# EAGLE design taGPS-1350 (EAGLE 7.5.0)
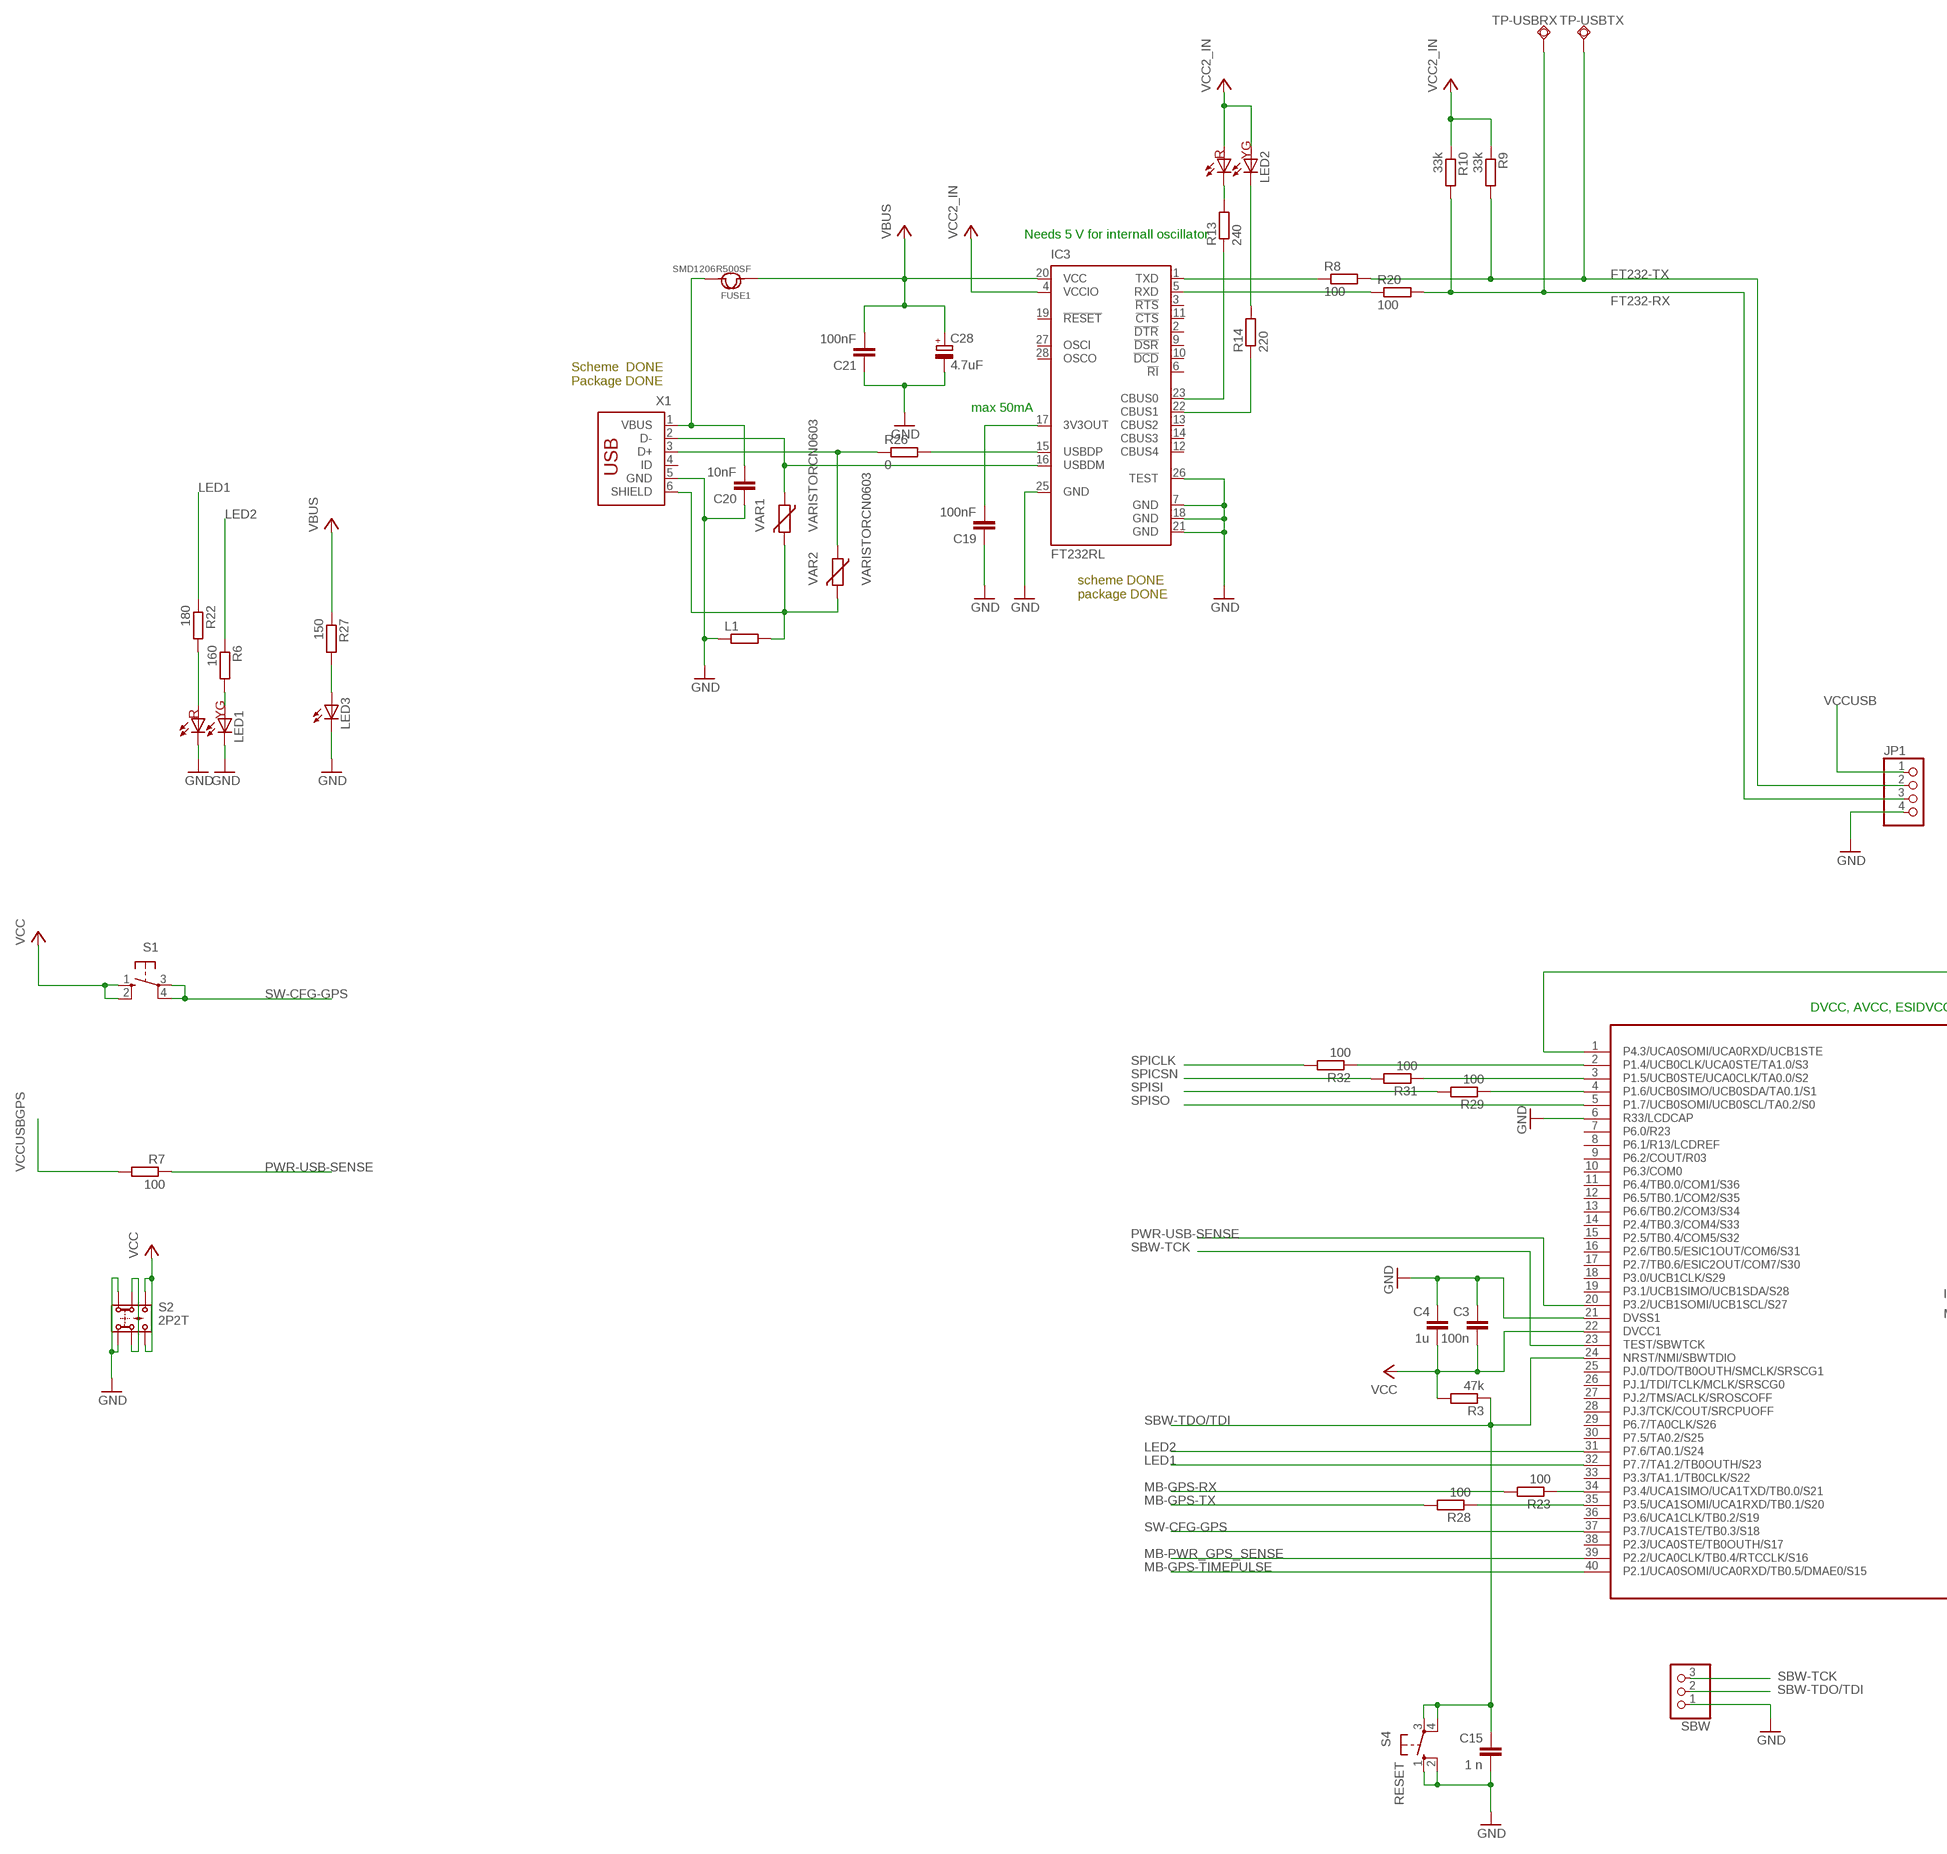
[diagram p0: schematic, sheet 1, part 1 of 2]
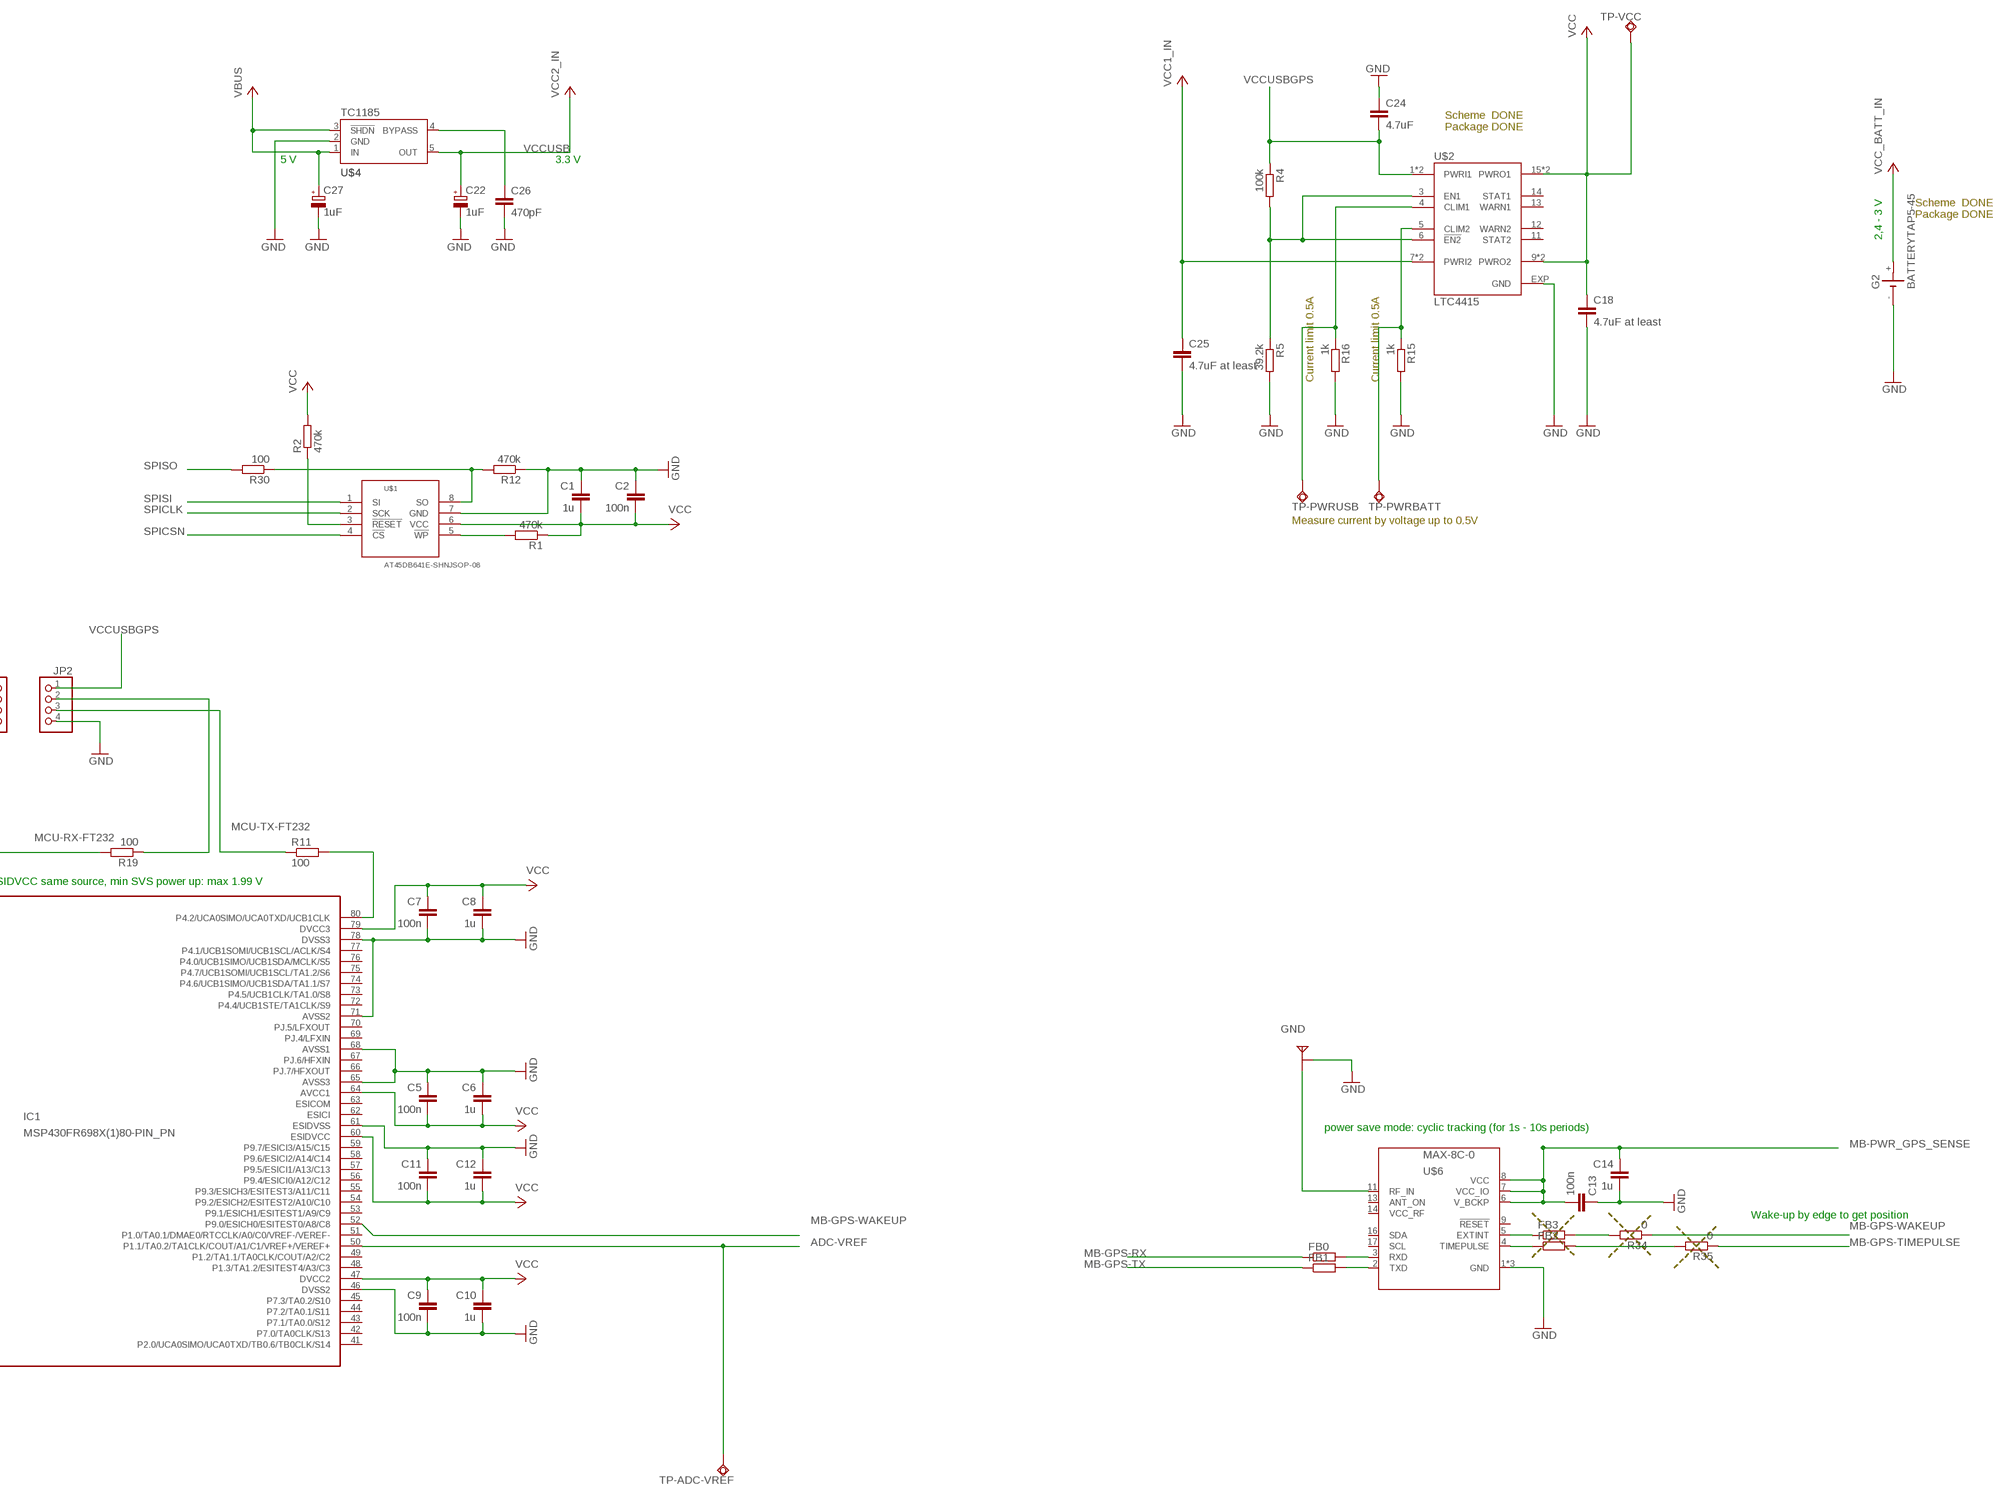
[diagram p1: schematic, sheet 1, part 2 of 2]

## Parts
C1  1u  C-EUC0603  [C0603]
C2  100n  C-EUC0603  [C0603]
C3  100n  C-EUC0603  [C0603]
C4  1u  C-EUC0603  [C0603]
C5  100n  C-EUC0603  [C0603]
C6  1u  C-EUC0603  [C0603]
C7  100n  C-EUC0603  [C0603]
C8  1u  C-EUC0603  [C0603]
C9  100n  C-EUC0603  [C0603]
C10  1u  C-EUC0603  [C0603]
C11  100n  C-EUC0603  [C0603]
C12  1u  C-EUC0603  [C0603]
C13  100n  C-EUC0603  [C0603]
C14  1u  C-EUC0603  [C0603]
C15  1 n  C-EUC0603  [C0603]
C18  4.7uF at least  C-EUC0805  [C0805]
C19  100nF  C-EUC0603  [C0603]
C20  10nF  C-EUC0603  [C0603]
C21  100nF  C-EUC0603  [C0603]
C22  1uF  CPOL-EUA/3216-18W  [A/3216-18W]
C24  4.7uF  C-EUC0805  [C0805]
C25  4.7uF at least  C-EUC0805  [C0805]
C26  470pF  C-EUC0603  [C0603]
C27  1uF  CPOL-EUA/3216-18W  [A/3216-18W]
C28  4.7uF  CPOL-EUA/3216-18W  [A/3216-18W]
FB0  R-EU_R0402  [R0402]
FB1  R-EU_R0402  [R0402]
FB2  R-EU_R0402  [R0402]
FB3  R-EU_R0402  [R0402]
FUSE1  SMD1206R500SF  SMD-PPTC-500MA-15V(1812)  [F1812]
G2  BATTERYTAP5-45  [TAP5-45]
IC1  MSP430FR698X(1)80-PIN_PN  [PN_S-PQFP-G80]
IC3  FT232RL  [SSOP28]
JP1  PINHD-1X4  [1X04]
JP2  PINHD-1X4  [1X04]
L1  R-EU_R0603  [R0603]
LED1  BILEDBILED  [BILED]
LED2  BILEDBILED  [BILED]
LED3  LED_E  [LED_KINGBRIGHT0603]
R1  470k  R-EU_R0603  [R0603]
R2  470k  R-EU_R0603  [R0603]
R3  47k  R-EU_R0603  [R0603]
R4  100k  R-EU_R0603  [R0603]
R5  39.2k  R-EU_R0603  [R0603]
R6  160  R-EU_R0603  [R0603]
R7  100  R-EU_R0603  [R0603]
R8  100  R-EU_R0603  [R0603]
R9  33k  R-EU_R0603  [R0603]
R10  33k  R-EU_R0603  [R0603]
R11  100  R-EU_R0603  [R0603]
R12  470k  R-EU_R0603  [R0603]
R13  240  R-EU_R0603  [R0603]
R14  220  R-EU_R0603  [R0603]
R15  1k  R-EU_R0603  [R0603]
R16  1k  R-EU_R0603  [R0603]
R19  100  R-EU_R0603  [R0603]
R20  100  R-EU_R0603  [R0603]
R22  180  R-EU_R0603  [R0603]
R23  100  R-EU_R0603  [R0603]
R26  0  R-EU_R0603  [R0603]
R27  150  R-EU_R0603  [R0603]
R28  100  R-EU_R0603  [R0603]
R29  100  R-EU_R0603  [R0603]
R30  100  R-EU_R0603  [R0603]
R31  100  R-EU_R0603  [R0603]
R32  100  R-EU_R0603  [R0603]
R34  0  R-EU_R0603  [R0603]
R35  0  R-EU_R0603  [R0603]
S1  SWITCH-10-XX  [B3F-10XX]
S2  2P2T  [2P2T]
S4  RESET  SWITCH-10-XX  [B3F-10XX]
SBW  PINHD-1X3  [1X03]
TP-ADC-VREF  TPSQTP10R  [TP10R]
TP-PWRBATT  TPSQTP10R  [TP10R]
TP-PWRUSB  TPSQTP10R  [TP10R]
TP-USBRX  TPSQPAD1-13  [P1-13]
TP-USBTX  TPSQPAD1-13  [P1-13]
TP-VCC  TPSQTP10R  [TP10R]
U$1  AT45DB641E-SHNJSOP-08  [JSOP-08]
U$2  LTC4415  [MSOP16]
U$4  TC1185  [SOT23-5]
U$5  MWSL1251MWSL1350  [MWSL1350]
U$6  MAX-8C-0  [MAX-8]
VAR1  VARISTORCN0603  [CT/CN0603]
VAR2  VARISTORCN0603  [CT/CN0603]
X1  USB-787616  [USB]

## Nets
ADC-BATT: R15.1 TP-PWRBATT.TP U$2.5(CLIM2)
ADC-VREF: IC1.50(P1.1/TA0.2/TA1CLK/COUT/A1/C1/VREF+/VEREF+) TP-ADC-VREF.TP
FT232-RX: JP1.3 R10.2 R20.2 TP-USBRX.TP
FT232-TX: JP1.2 R8.2 R9.2 TP-USBTX.TP
GND: C1.1 C2.1 C3.1 C4.1 C5.1 C6.1 C7.2 C8.2 C9.2 C10.2 C11.1 C12.1 C13.1 C14.2 C15.2 C18.2 C19.1 C20.1 C21.1 C22.- C24.1 C25.2 C26.2 C27.- C28.- G2.- IC1.6(R33/LCDCAP) IC1.21(DVSS1) IC1.46(DVSS2) IC1.61(ESIDVSS) IC1.65(AVSS3) IC1.68(AVSS1) IC1.71(AVSS2) IC1.78(DVSS3) IC3.7(GND) IC3.18(GND) IC3.21(GND) IC3.25(GND) IC3.26(TEST) JP1.4 JP2.4 L1.1 LED1.1 LED1.3 LED3.C R5.2 R12.1 R15.2 R16.2 S2.1.1 S2.1.2 S4.1(S) S4.2(S1) SBW.1 U$1.7(GND) U$2.EXP(GND) U$4.2(GND) U$5.P$1(GND) U$5.P$3(GND) U$6.1(GND) U$6.10(GND) U$6.12(GND) X1.5(GND)
LED1: IC1.32(P7.7/TA1.2/TB0OUTH/S23) R22.1
LED2: IC1.31(P7.6/TA0.1/S24) R6.1
MB-GPS-RX: FB0.1 R23.2
MB-GPS-TIMEPULSE: IC1.40(P2.1/UCA0SOMI/UCA0RXD/TB0.5/DMAE0/S15) R35.1
MB-GPS-TX: FB1.1 R28.2
MB-GPS-WAKEUP: IC1.52(P9.0/ESICH0/ESITEST0/A8/C8) R34.1
MB-PWR_GPS_SENSE: C13.2 C14.1 IC1.39(P2.2/UCA0CLK/TB0.4/RTCCLK/S16) S2.2.1 S2.2.2 U$6.6(V_BCKP) U$6.7(VCC_IO) U$6.8(VCC)
MCU-RX-FT232: IC1.1(P4.3/UCA0SOMI/UCA0RXD/UCB1STE) R19.2
MCU-TX-FT232: JP2.3 R11.1
N$1: IC3.1(TXD) R8.1
N$2: IC1.80(P4.2/UCA0SIMO/UCA0TXD/UCB1CLK) R11.2
N$3: IC1.4(P1.6/UCB0SIMO/UCB0SDA/TA0.1/S1) R29.1
N$4: IC3.5(RXD) R20.1
N$5: R2.1 U$1.3(!RESET)
N$7: R4.2 R5.1 U$2.3(EN1) U$2.6(!EN2)
N$8: JP2.2 R19.1
N$10: C19.2 IC3.17(3V3OUT)
N$11: R1.2 U$1.5(!WP)
N$12: R26.1 VAR2.1 X1.3(D+)
N$13: IC3.16(USBDM) VAR1.1 X1.2(D-)
N$14: R12.2 R30.1 U$1.8(SO)
N$15: FB0.2 U$6.3(RXD)
N$16: IC3.23(CBUS0) R13.1
N$17: IC3.22(CBUS1) R14.1
N$18: LED2.1 R13.2
N$19: LED2.3 R14.2
N$22: C20.2 FUSE1.2 X1.1(VBUS)
N$23: L1.2 VAR1.2 VAR2.2 X1.6(SHIELD)
N$24: IC1.2(P1.4/UCB0CLK/UCA0STE/TA1.0/S3) R32.1
N$25: R16.1 TP-PWRUSB.TP U$2.4(CLIM1)
N$26: FB1.2 U$6.2(TXD)
N$27 [charimp50]: U$5.P$2(FEED) U$6.11(RF_IN)
N$29: IC3.15(USBDP) R26.2
N$32: C26.1 U$4.4(BYPASS)
N$33: LED1.4 R6.2
N$34: LED1.2 R22.2
N$35: IC1.3(P1.5/UCB0STE/UCA0CLK/TA0.0/S2) R31.1
N$36: IC1.34(P3.4/UCA1SIMO/UCA1TXD/TB0.0/S21) R23.1
N$37: LED3.A R27.2
N$45: IC1.35(P3.5/UCA1SOMI/UCA1RXD/TB0.1/S20) R28.1
N$46: FB3.2 R34.2
N$47: FB2.2 R35.2
N$49: FB2.1 U$6.4(TIMEPULSE)
N$50: FB3.1 U$6.5(EXTINT)
PWR-USB-SENSE: IC1.20(P3.2/UCB1SOMI/UCB1SCL/S27) R7.1
SBW-TCK: IC1.23(TEST/SBWTCK) SBW.3
SBW-TDO/TDI: C15.1 IC1.24(NRST/NMI/SBWTDIO) R3.1 S4.3(P) S4.4(P1) SBW.2
SPICLK: R32.2 U$1.2(SCK)
SPICSN: R31.2 U$1.4(!CS)
SPISI: R29.2 U$1.1(SI)
SPISO: IC1.5(P1.7/UCB0SOMI/UCB0SCL/TA0.2/S0) R30.2
SW-CFG-GPS: IC1.37(P3.7/UCA1STE/TB0.3/S18) S1.3(P) S1.4(P1)
VBUS: C21.2 C27.+ C28.+ FUSE1.1 IC3.20(VCC) R27.1 U$4.1(IN) U$4.3(!SHDN)
VCC: C1.2 C2.2 C3.2 C4.2 C5.2 C6.2 C7.1 C8.1 C9.1 C10.1 C11.2 C12.2 C18.1 IC1.22(DVCC1) IC1.47(DVCC2) IC1.60(ESIDVCC) IC1.64(AVCC1) IC1.79(DVCC3) R1.1 R2.2 R3.2 S1.1(S) S1.2(S1) S2.3.1 S2.3.2 TP-VCC.TP U$1.6(VCC) U$2.9(PWRO2) U$2.10(PWRO2) U$2.15(PWRO1) U$2.16(PWRO1)
VCC_BATT_IN: C25.1 G2.+ U$2.7(PWRI2) U$2.8(PWRI2) ; supply symbol labelled VCC1_IN
VCCUSB: C22.+ IC3.4(VCCIO) JP1.1 LED2.2 LED2.4 R9.1 R10.1 U$4.5(OUT) ; supply symbol labelled VCC2_IN
VCCUSBGPS: C24.2 JP2.1 R4.1 R7.2 U$2.1(PWRI1) U$2.2(PWRI1)
Unconnected: IC1.7(P6.0/R23) IC1.8(P6.1/R13/LCDREF) IC1.9(P6.2/COUT/R03) IC1.10(P6.3/COM0) IC1.11(P6.4/TB0.0/COM1/S36) IC1.12(P6.5/TB0.1/COM2/S35) IC1.13(P6.6/TB0.2/COM3/S34) IC1.14(P2.4/TB0.3/COM4/S33) IC1.15(P2.5/TB0.4/COM5/S32) IC1.16(P2.6/TB0.5/ESIC1OUT/COM6/S31) IC1.17(P2.7/TB0.6/ESIC2OUT/COM7/S30) IC1.18(P3.0/UCB1CLK/S29) IC1.19(P3.1/UCB1SIMO/UCB1SDA/S28) IC1.25(PJ.0/TDO/TB0OUTH/SMCLK/SRSCG1) IC1.26(PJ.1/TDI/TCLK/MCLK/SRSCG0) IC1.27(PJ.2/TMS/ACLK/SROSCOFF) IC1.28(PJ.3/TCK/COUT/SRCPUOFF) IC1.29(P6.7/TA0CLK/S26) IC1.30(P7.5/TA0.2/S25) IC1.33(P3.3/TA1.1/TB0CLK/S22) IC1.36(P3.6/UCA1CLK/TB0.2/S19) IC1.38(P2.3/UCA0STE/TB0OUTH/S17) IC1.41(P2.0/UCA0SIMO/UCA0TXD/TB0.6/TB0CLK/S14) IC1.42(P7.0/TA0CLK/S13) IC1.43(P7.1/TA0.0/S12) IC1.44(P7.2/TA0.1/S11) IC1.45(P7.3/TA0.2/S10) IC1.48(P1.3/TA1.2/ESITEST4/A3/C3) IC1.49(P1.2/TA1.1/TA0CLK/COUT/A2/C2) IC1.51(P1.0/TA0.1/DMAE0/RTCCLK/A0/C0/VREF-/VEREF-) IC1.53(P9.1/ESICH1/ESITEST1/A9/C9) IC1.54(P9.2/ESICH2/ESITEST2/A10/C10) IC1.55(P9.3/ESICH3/ESITEST3/A11/C11) IC1.56(P9.4/ESICI0/A12/C12) IC1.57(P9.5/ESICI1/A13/C13) IC1.58(P9.6/ESICI2/A14/C14) IC1.59(P9.7/ESICI3/A15/C15) IC1.62(ESICI) IC1.63(ESICOM) IC1.66(PJ.7/HFXOUT) IC1.67(PJ.6/HFXIN) IC1.69(PJ.4/LFXIN) IC1.70(PJ.5/LFXOUT) IC1.72(P4.4/UCB1STE/TA1CLK/S9) IC1.73(P4.5/UCB1CLK/TA1.0/S8) IC1.74(P4.6/UCB1SIMO/UCB1SDA/TA1.1/S7) IC1.75(P4.7/UCB1SOMI/UCB1SCL/TA1.2/S6) IC1.76(P4.0/UCB1SIMO/UCB1SDA/MCLK/S5) IC1.77(P4.1/UCB1SOMI/UCB1SCL/ACLK/S4) IC3.2(!DTR) IC3.3(!RTS) IC3.6(!RI) IC3.9(!DSR) IC3.10(!DCD) IC3.11(!CTS) IC3.12(CBUS4) IC3.13(CBUS2) IC3.14(CBUS3) IC3.19(!RESET) IC3.27(OSCI) IC3.28(OSCO) U$2.11(STAT2) U$2.12(WARN2) U$2.13(WARN1) U$2.14(STAT1) U$6.9(!RESET) U$6.13(ANT_ON) U$6.14(VCC_RF) U$6.16(SDA) U$6.17(SCL) X1.4(ID)

## Notes on the sheet
- Scheme  DONE
  Package DONE
- 5 V | 3.3 V
- Scheme  DONE
  Package DONE
- 2,4 - 3 V
- Needs 5 V for internall oscillator
- Scheme  DONE
  Package DONE
- Current limit 0.5A | Current limit 0.5A
- max 50mA
- Measure current by voltage up to 0.5V
- scheme DONE
  package DONE
- DVCC, AVCC, ESIDVCC same source, min SVS power up: max 1.99 V
- power save mode: cyclic tracking (for 1s - 10s periods)
- Wake-up by edge to get position

## Library data of the parts
C1-C15 C18-C21 C24-C26 = tagps:C-EU: CAPACITOR, European symbol; SPICEPREFIX: C
C22 C27 C28 = tagps:CPOL-EU: POLARIZED CAPACITOR, European symbol
FB0 FB1-FB3 L1 R1-R16 R19 R20 R22 R23 R26-R32 R34 R35 = tagps:R-EU_: RESISTOR, European symbol; SPICEPREFIX: R
FUSE1 = tagps:SMD-PPTC-500MA-15V(1812): 307010007; MPN: SMD1206R500SF
G2 = tagps:BATTERY: LI BATTERY Sonnenschein
IC1 = tagps:MSP430FR698X(1): Ultra-Low-Power MCU Source: http://www.ti.com/lit/ds/symlink/msp430fr6989.pdf
IC3 = tagps:FT232R: Source: http://www.ftdichip.com/Documents/DataSheets/DS_FT232R_v104.pdf; MPN: FT232RL; OC_FARNELL: 1146032; OC_NEWARK: 91K9918
JP1 JP2 = tagps:PINHD-1X4: PIN HEADER
LED1 LED2 = tagps:BILED: LED Source: http://www.osram.convergy.de Source: www.luxeon.com Source: www.kingbright.com
LED3 = tagps:LED_E: LED Source: http://www.osram.convergy.de Source: www.luxeon.com Source: www.kingbright.com
S1 S4 = tagps:SWITCH-10-XX: OMRON SWITCH; MPN: B3F-1000; OC_FARNELL: 176432; OC_NEWARK: 36M3542
S2 = tagps:2P2T: SLIDE SWITCH 2P2T Part No. SS-22F05-G(A)4 Source: CANAL ELECTRONIC CO., LTD .. switsch.pdf
SBW = tagps:PINHD-1X3: PIN HEADER
TP-ADC-VREF TP-PWRBATT TP-PWRUSB TP-USBRX TP-USBTX TP-VCC = tagps:TPSQ: Test pad
U$1 = tagps:AT45DB641E-SHN
U$2 = tagps:LTC4415
U$4 = tagps:TC1185
U$5 = tagps:MWSL1251
U$6 = tagps:MAX-8C-0
VAR1 VAR2 = tagps:VARISTOR: VARISTOR
X1 = tagps:USB-787616: AMP connector

## Net classes
0 signal: width 0.254 mm, drill 0.254 mm, clearance 0.025 mm
1 charimp50: width 0.61 mm, drill 0.254 mm, clearance 0.559 mm
2 conect: width 0.254 mm, drill 0.254 mm

## Board
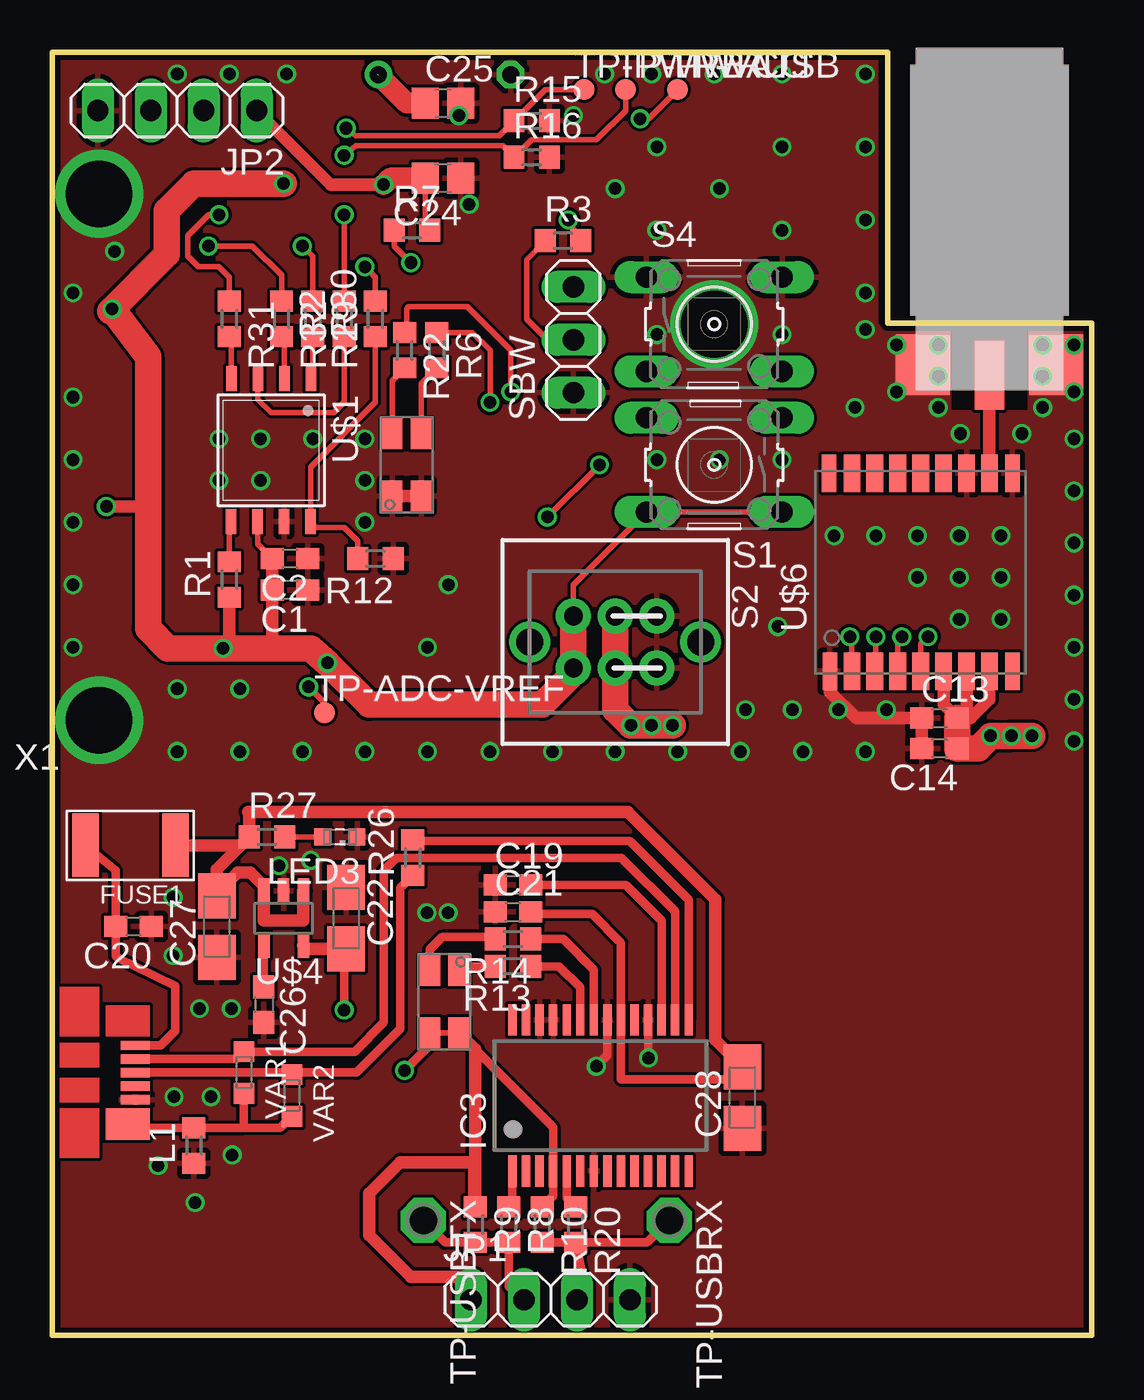
[diagram p2: board, top side]
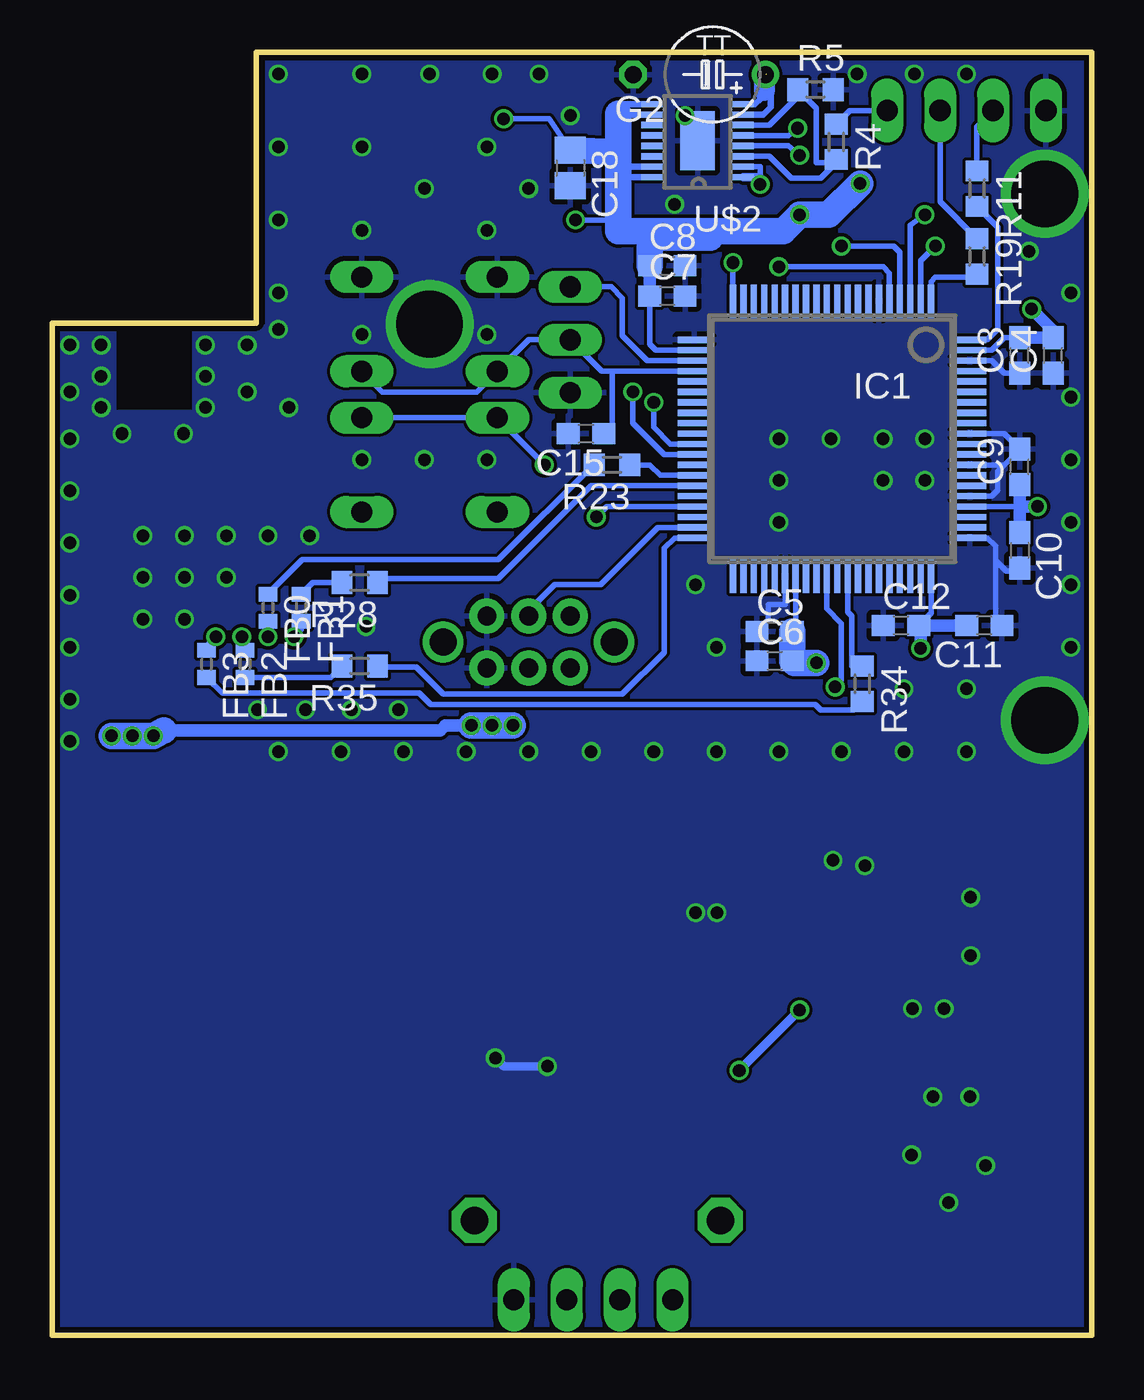
[diagram p3: board, bottom side, seen from below]

Size 49.85 x 61.55 mm. Coordinates in mm from the lower left corner, seen from the top.
Outline: 0,0 49.85,0 49.85,48.55 40.07,48.55 40.07,61.55 0,61.55 0,0
Copper layers (1*16): Top 0.035mm / dielectric 1.5mm / Bottom 0.035mm
Design rules "SeeedStudio_2layer_DRU_no_angle_20140221": minimum track width 6mil, minimum drill 12mil, track to track 6mil, track to pad 6mil, pad to pad 6mil, via to via 6mil, smd to smd 0mil, copper to edge 10mil, drill to drill 10mil, minimum pad ring 10mil, minimum via ring 6mil, stop-mask expansion 2mil, vias tented up to drill 100mil, thermal gap 10mil

### Footprints (pad centres in the part's own frame; a part is rotated, then mirrored left to right if it is on the bottom)
C0603 = smd 1.1 x 1: 1 -0.85,0; 2 0.85,0
C0805 = smd 1.3 x 1.5: 1 -0.85,0; 2 0.85,0
A/3216-18W = smd 2.15 x 1.8: + 1.475,0; - -1.475,0
R0402 = smd 0.7 x 0.9: 1 -0.65,0; 2 0.65,0
F1812 = smd 1.27 x 3.048: 1 -2.159,0; 2 2.159,0
TAP5-45 = drill 0.813: + -2.54,0 | drill 0.813 octagon: - 3.81,0
PN_S-PQFP-G80 = smd 0.3 x 1.6: 1 -4.75,-6.6; 2 -4.25,-6.6; 3 -3.75,-6.6; 4 -3.25,-6.6; 5 -2.75,-6.6; 6 -2.25,-6.6; 7 -1.75,-6.6; 8 -1.25,-6.6; 9 -0.75,-6.6; 10 -0.25,-6.6; 11 0.25,-6.6; 12 0.75,-6.6; 13 1.25,-6.6; 14 1.75,-6.6; 15 2.25,-6.6; 16 2.75,-6.6; 17 3.25,-6.6; 18 3.75,-6.6; 19 4.25,-6.6; 20 4.75,-6.6; 41 4.75,6.6; 42 4.25,6.6; 43 3.75,6.6; 44 3.25,6.6; 45 2.75,6.6; 46 2.25,6.6; 47 1.75,6.6; 48 1.25,6.6; 49 0.75,6.6; 50 0.25,6.6; 51 -0.25,6.6; 52 -0.75,6.6; 53 -1.25,6.6; 54 -1.75,6.6; 55 -2.25,6.6; 56 -2.75,6.6; 57 -3.25,6.6; 58 -3.75,6.6; 59 -4.25,6.6; 60 -4.75,6.6 | smd 1.6 x 0.3: 21 6.6,-4.75; 22 6.6,-4.25; 23 6.6,-3.75; 24 6.6,-3.25; 25 6.6,-2.75; 26 6.6,-2.25; 27 6.6,-1.75; 28 6.6,-1.25; 29 6.6,-0.75; 30 6.6,-0.25; 31 6.6,0.25; 32 6.6,0.75; 33 6.6,1.25; 34 6.6,1.75; 35 6.6,2.25; 36 6.6,2.75; 37 6.6,3.25; 38 6.6,3.75; 39 6.6,4.25; 40 6.6,4.75; 61 -6.6,4.75; 62 -6.6,4.25; 63 -6.6,3.75; 64 -6.6,3.25; 65 -6.6,2.75; 66 -6.6,2.25; 67 -6.6,1.75; 68 -6.6,1.25; 69 -6.6,0.75; 70 -6.6,0.25; 71 -6.6,-0.25; 72 -6.6,-0.75; 73 -6.6,-1.25; 74 -6.6,-1.75; 75 -6.6,-2.25; 76 -6.6,-2.75; 77 -6.6,-3.25; 78 -6.6,-3.75; 79 -6.6,-4.25; 80 -6.6,-4.75
SSOP28 = smd 0.4 x 1.5: 1 -4.225,-3.625; 2 -3.575,-3.625; 3 -2.925,-3.625; 4 -2.275,-3.625; 5 -1.625,-3.625; 6 -0.975,-3.625; 7 -0.325,-3.625; 8 0.325,-3.625; 9 0.975,-3.625; 10 1.625,-3.625; 11 2.275,-3.625; 12 2.925,-3.625; 13 3.575,-3.625; 14 4.225,-3.625; 15 4.225,3.625; 16 3.575,3.625; 17 2.925,3.625; 18 2.275,3.625; 19 1.625,3.625; 20 0.975,3.625; 21 0.325,3.625; 22 -0.325,3.625; 23 -0.975,3.625; 24 -1.625,3.625; 25 -2.275,3.625; 26 -2.925,3.625; 27 -3.575,3.625; 28 -4.225,3.625
1X04 = drill 1.016 long: 1 -3.81,0; 2 -1.27,0; 3 1.27,0; 4 3.81,0
R0603 = smd 1 x 1.1: 1 -0.85,0; 2 0.85,0
BILED = smd 1.5 x 1: 1 -1.5,0.7; 2 1.5,0.7; 3 -1.5,-0.7; 4 1.5,-0.7
LED_KINGBRIGHT0603 = smd 0.8 x 0.8: A 0.825,0; C -0.825,0
B3F-10XX = drill 1.016 long: 1 -3.251,2.261; 2 3.251,2.261; 3 -3.251,-2.261; 4 3.251,-2.261
2P2T = drill 0.9 pad 1.676: 1.1 -2,1.25; 1.2 -2,-1.25; 2.1 0,1.25; 2.2 0,-1.25; 3.1 2,1.25; 3.2 2,-1.25 | drill 1.3 pad 1.93: 3.3 4.1,0; 3.4 -4.1,0
1X03 = drill 1.016 long: 1 -2.54,0; 2 0,0; 3 2.54,0
TP10R = smd 1 x 1: TP 0,0
P1-13 = drill 1.321 pad 2.159 octagon: TP 0,0
JSOP-08 = smd 0.5 x 1.2: 1 -1.905,-3.429; 2 -0.635,-3.429; 3 0.635,-3.429; 4 1.905,-3.429; 5 1.913,3.429; 6 0.643,3.429; 7 -0.627,3.429; 8 -1.897,3.429
MSOP16 = smd 1 x 0.3: 1 -2.2,1.75; 2 -2.2,1.25; 3 -2.2,0.75; 4 -2.2,0.25; 5 -2.2,-0.25; 6 -2.2,-0.75; 7 -2.2,-1.25; 8 -2.2,-1.75; 9 2.2,-1.75; 10 2.2,-1.25; 11 2.2,-0.75; 12 2.2,-0.25; 13 2.2,0.25; 14 2.2,0.75; 15 2.2,1.25; 16 2.2,1.75 | smd 1.65 x 2.85: EXP 0,0
SOT23-5 = smd 0.55 x 1.2: 1 -0.95,-1.3; 2 0,-1.3; 3 0.95,-1.3; 4 0.95,1.3; 5 -0.95,1.3
MWSL1350 = smd 2.6 x 2.9: P$1 -3.2,-1.45; P$3 3.2,-1.45 | smd 1.4 x 3.3: P$2 0,-1.95
MAX-8 = smd 1.8 x 0.7: 1 9.6,0.7; 9 9.6,9.45; 10 0.1,9.45; 18 0.1,0.65 | smd 1.8 x 0.8: 2 9.6,1.75; 3 9.6,2.85; 4 9.6,3.95; 5 9.6,5.05; 6 9.6,6.15; 7 9.6,7.25; 8 9.6,8.35; 11 0.1,8.35; 12 0.1,7.25; 13 0.1,6.15; 14 0.1,5.05; 15 0.1,3.95; 16 0.1,2.85; 17 0.1,1.75
CT/CN0603 = smd 1 x 1: 1 -1,0; 2 1,0
USB = smd 1.38 x 0.45: 1 -0.69,1.3; 2 -0.69,0.65; 3 -0.69,0; 4 -0.69,-0.65; 5 -0.69,-1.3 | smd 2.1 x 1.5: 6 -1.05,-2.47

### Placement (x,y rotation side)
C1  11.4,35.75 180 top
C2  11.4,37.25 180 top
C3  3.45,47 90 bottom
C4  1.85,47 90 bottom
C5  15.2,33.75 0 bottom
C6  15.2,32.35 0 bottom
C7  20.35,49.85 0 bottom
C8  20.35,51.3 0 bottom
C9  3.45,41.65 90 bottom
C10  3.45,37.65 270 bottom
C11  5.15,34.05 180 bottom
C12  9.15,34.05 0 bottom
C13  42.55,29.6 0 top
C14  42.55,28.15 180 top
C15  24.25,43.25 180 bottom
C18  25,56 270 bottom
C19  22.1,21.6 0 top
C20  3.9,19.6 180 top
C21  22.1,20.3 0 top
C22  14.1,20 270 top
C24  18.75,55.5 180 top
C25  18.75,59.1 0 top
C26  10.15,15.85 270 top
C27  7.9,19.6 90 top
C28  33.1,11.4 90 top
FB0  39.5,34.9 270 bottom
FB1  37.9,34.9 270 bottom
FB2  40.6,32.2 270 bottom
FB3  42.45,32.2 270 bottom
FUSE1  3.75,23.5 180 top
G2  18.18,60.47 180 bottom
IC1  12.45,43 180 bottom
IC3  26.3,11.5 0 top
JP1  23.9,1.7 0 top
JP2  6,58.75 180 top
L1  6.8,9.1 90 top
LED1  17,41.75 90 top
LED2  18.8,16 270 top
LED3  13.8,23.9 180 top
R1  8.5,36.25 90 top
R2  14,48.75 90 top
R3  24.5,52.5 0 top
R4  12.25,57.25 270 bottom
R5  13.25,59.75 0 bottom
R6  18.45,47.25 270 top
R7  17.25,53 0 top
R8  21.9,5.3 270 top
R9  20.3,5.3 270 top
R10  23.5,5.3 270 top
R11  5.5,55 270 bottom
R12  15.5,37.25 180 top
R13  22.1,17.7 180 top
R14  22.1,19 180 top
R15  23,58.25 0 top
R16  23,56.5 0 top
R19  5.5,51.75 270 bottom
R20  25.1,5.3 270 top
R22  16.9,47.25 270 top
R23  23,41.75 180 bottom
R26  17.3,22.9 90 top
R27  10.3,23.9 0 top
R28  35.1,36.1 180 bottom
R29  12.5,48.75 270 top
R30  15.5,48.75 90 top
R31  8.5,48.75 270 top
R32  11,48.75 270 top
R34  11,31.25 270 bottom
R35  35.1,32.1 180 bottom
S1  31.75,41.75 180 top
S2  27,33.25 180 top
S4  31.75,48.5 0 top
SBW  25,47.75 90 top
TP-ADC-VREF  13.05,29.85 0 top
TP-PWRBATT  25.5,59.75 0 top
TP-PWRUSB  27.5,59.75 0 top
TP-USBRX  29.6,5.5 270 top
TP-USBTX  17.8,5.5 270 top
TP-VCC  30,59.75 0 top
U$1  10.5,42.45 180 top
U$2  18.9,57.3 180 bottom
U$4  11.1,20 180 top
U$5  44.95,48.01 0 top
U$6  36.6,41.45 270 top
VAR1  9.2,12.6 270 top
VAR2  11.5,11.5 270 top
X1  4.67,12.6 0 top

### Tracks (layer width: path | path; a pad name or v marks a point on that pad's centre or on a via)
ADC-BATT  (via drill 0.6)
  Top 0.254: v14.1,57.9 14.55,57.55 21.45,57.55 R15.1 23.65,59.75 TP-PWRBATT.TP
  Bottom 0.254: U$2.5 14.55,57.55 v14.1,57.9
ADC-VREF  (via drill 0.6)
  Top 0.254: TP-ADC-VREF.TP 13.05,30.35 v12.3,31.1
  Bottom 0.254: IC1.50 12.7,34.85 12,34.15 12,31.4 v12.3,31.1
FT232-RX
  Top 0.406: R10.2 R20.2 | R20.2 28.55,4.45 TP-USBRX.TP | JP1.3 25.6,2.13 R20.2
FT232-TX
  Top 0.406: TP-USBTX.TP 18.85,4.45 R9.2 R8.2 21.9,2.33 JP1.2
GND  (via drill 0.6, 3.2 pad 3.81)
  Top 0.254: U$6.12 43.73,41.23
  Top 0.406: IC3.21 26.62,13.43 v26.1,12.9 | v28.6,13.3 28.57,13.57 IC3.18
  Top 0.61: LED1.1 LED1.3 | U$6.1 37.3,30.85 38.55,29.6 C13.1 C14.2
  Bottom 0.254: 19.2,47.75 IC1.21 | 16.2,34.1 C5.1 15.5,34.3 15.5,35.05 14.7,35.05 IC1.46 | IC1.61 5,38.25 4.6,37.85 4.6,37.15 | 4.6,37.15 4.1,36.65 3.6,36.65 C10.2 | IC1.78 4.8,46.75 4.2,46.15 C3.1 | 4.3,34.15 4.6,34.45 4.6,37.15 | IC1.71 4.2,43.25 C9.2 4.2,41.75 | IC1.68 4.2,41.75 | IC1.65 4.8,40.25 4.5,40.55 4.5,41.45 4.2,41.75
  Bottom 0.406: v26.1,12.9 28.2,12.9 v28.6,13.3
  other vias: 15,39 8,41 10,41 15,41 15,43 12.5,43 10,43 8,43 5.8,21 5.84,11.44 39,57 45.5,38.35 43.5,38.35 41.5,38.35 45.5,36.35 43.5,36.35 43.5,34.35 41.5,36.35 45.5,34.35 39.5,38.35 37.5,38.35 31.75,60.5 42.5,44.5 43.55,43.25 49,47.5 47.5,47.5 39,53.5 7.62,11.44 8.64,8.64 6.86,6.36 5.08,8.14 12.4,22.78 10.88,22.52 8.59,15.67 7.07,15.67 5.8,18.21 17.97,20.27 18.99,20.27 25,58.5 39,60.5 35,60.5 35,57 35,53 20,54.25 19.5,58.5 39,50 39,48.25 40.5,47.5 42.5,47.5 42.5,46 49,45.25 49,43 47.5,46 47.5,44.5 46.5,43.25 49,40.5 49,38 49,35.5 49,33 49,30.5 49,28.5 39,28 38.5,44.5 40.5,45.25 36,28 33,28 27,28 30,28 24,28 21,28 18,28 15,28 12,28 9,28 6,28 6,31 9,31 1,33 1,36 1,39 1,42 1,45 1,50 3,52 35.5,30 33.25,30 34.8,34 35,42 32,42 29,42 18,33 19,36 29,53 32,55 29,57 31.75,48.5 2.25,29.5 2.25,54.75 37.7,30 40,30 35,48 29,48 27,55 8.5,60.5 6,60.5 28.75,60.5 26.5,60.5 11.25,60.5
  pour Top: -1.6,63.35 38.5,63.25 41.5,63.25 41.5,48.5 37.25,48.5 37.25,44.1 39,44.1 50.5,44.35 49.9,-0.5 -2.35,-0.75
  pour Bottom: -3.05,64 50.95,64 50.8,-1.05 -2.95,-1.4 -2.95,23.25 -3.15,33.75
  pour Top (no thermals): 37.25,49 51,49 51,43.75 37.25,43.75 37.25,44
LED1  (via drill 0.6)
  Top 0.254: R22.1 17,48.2 17,49.25 17.1,49.35 19.9,49.35 22,47.25 v22,45.25
  Bottom 0.254: IC1.32 20.5,42.25 22,43.75 v22,45.25
LED2  (via drill 0.6)
  Top 0.254: v21,44.75 21,47.25 20.15,48.1 R6.1
  Bottom 0.254: IC1.31 20.2,42.75 21,43.55 v21,44.75
MB-GPS-RX
  Bottom 0.254: R23.2 23.9,41.75 28.45,37.2 37.85,37.2 FB0.1
MB-GPS-TIMEPULSE
  Bottom 0.254: IC1.40 20,38.25 20.5,37.75 20.5,32.75 22.5,30.75 31.1,30.75 32.4,32.05 34.2,32.05 R35.1
MB-GPS-TX
  Bottom 0.254: FB1.1 37.35,36.1 R28.2
MB-GPS-WAKEUP
  Bottom 0.254: IC1.52 11.7,34.7 11.5,34.5 11.5,32.1 R34.1
MB-PWR_GPS_SENSE  (via drill 0.6)
  Top 0.254: 44.05,29.6 C13.2
  Top 0.61: U$6.7 43.85,30.05 C13.2 42.75,30.25 U$6.6 | 44.05,29.6 44.95,30.5 U$6.8
  Top 1.27: C13.2 C14.1 44.4,28.15 v45,28.75 v46,28.75 v47,28.75 | S2.2.2 S2.2.1 27,30 v27.75,29.25 v28.75,29.25 v29.75,29.25
  Bottom 0.254: IC1.39 20.8,38.75 23.55,36 25.75,36 27,34.75 S2.2.2
  Bottom 0.61: 44.5,29 31.25,29 31,29.25 v29.75,29.25
  Bottom 1.27: v27.75,29.25 v28.75,29.25 v29.75,29.25 | 44.5,29 v45,28.75 v47,28.75
MCU-RX-FT232
  Bottom 0.254: IC1.1 7.7,50.55 7.5,50.75 5.65,50.75 R19.2
MCU-TX-FT232
  Bottom 0.254: R11.1 5.5,57.98 JP2.3
N$1
  Top 0.406: R8.1 arc90 22.07,6.33 IC3.1
N$2
  Bottom 0.254: IC1.80 5,47.75 4.5,48.25 4.5,53.15 R11.2
N$3  (via drill 0.6)
  Top 0.254: v12,52.25 12.5,51.75 R29.1
  Bottom 0.254: IC1.4 9.2,51.95 9.5,52.25 v12,52.25
N$4
  Top 0.406: IC3.5 24.68,6.58 R20.1
N$5
  Top 0.254: U$1.3 9.87,44.88 10.5,44.25 13.5,44.25 14,44.75 R2.1
N$7
  Bottom 0.254: U$2.3 15.45,56.55 14.4,55.5 13,55.5 12.25,56.25 | U$2.6 15.45,58.05 14.1,59.4 R5.1 13.2,58.85 13.2,56.25 12.25,56.25 | 12.25,56.25 R4.2
N$8
  Bottom 0.254: R19.1 7.27,54.37 JP2.2
N$10
  Top 0.406: IC3.17 29.23,19.88 27.5,21.6 C19.2
N$11
  Top 0.254: U$1.5 8.5,38.93 R1.2
N$12
  Top 0.406: R26.1 16.7,21.45 16.7,14.7 14.6,12.6 11.6,12.6 | 11.6,12.6 VAR2.1 | 11.6,12.6 X1.3
N$13
  Top 0.406: X1.2 8.85,13.25 VAR1.1 14.5,13.6 15.9,15 15.9,22.3 16.5,22.9 27.3,22.9 29.88,20.32 IC3.16
N$14
  Top 0.254: R30.1 15.5,44.75 12.4,41.65 U$1.8 | 12.5,38.92 U$1.8 | R12.2 14.65,38.1 14,38.75 12.67,38.75 U$1.8
N$15  (via drill 0.6)
  Top 0.254: U$6.3 39.5,31.9 v39.5,33.5
  Bottom 0.254: v39.5,33.5 FB0.2
N$16
  Top 0.406: IC3.23 25.32,16.68 24.3,17.7 R13.1
N$17
  Top 0.406: R14.1 24.5,19 25.98,17.52 IC3.22
N$18
  Top 0.406: LED2.1 19.7,17.7 R13.2
N$19
  Top 0.406: R14.2 21.15,19.1 18.7,19.1 18.1,18.5 LED2.3
N$22
  Top 0.406: X1.1 5.2,13.9 5.9,14.6 5.9,16.75 3.15,18.1 3.05,18.2 C20.2 3.05,22.29 FUSE1.2
N$23
  Top 0.406: X1.6 3.8,9.95 L1.2 9.2,9.95 | 9.2,9.95 VAR1.2 | VAR2.2 10.95,9.95 9.2,9.95
N$24  (via drill 0.6)
  Top 0.254: R32.1 11,50.85 9.6,52.25 v7.5,52.25
  Bottom 0.254: IC1.2 8.2,51.55 v7.5,52.25
N$25  (via drill 0.6)
  Top 0.254: v14,56.6 14.55,57.05 21.6,57.05 R16.1 23,57.35 26.1,57.35 27.5,58.75 TP-PWRUSB.TP
  Bottom 0.254: U$2.4 14.55,57.05 v14,56.6
N$26  (via drill 0.6)
  Top 0.254: U$6.2 38.35,33.4 v38.25,33.5
  Bottom 0.254: v38.25,33.5 37.9,33.85 FB1.2
N$27
  Top 0.61: 44.9,41.35 U$6.11 U$5.P$2
N$29
  Top 0.406: R26.2 17.35,23.7 27.7,23.7 30.52,20.88 IC3.15
N$32
  Top 0.406: 10.2,18.7 U$4.4 C26.1
N$33
  Top 0.254: R6.2 17.7,45.65 LED1.4
N$34
  Top 0.254: R22.2 16.3,45.8 LED1.2
N$35  (via drill 0.6)
  Top 0.254: R31.1 8.5,50.75 8,51.25 7,51.25 6.5,51.75 6.5,52.75 7.5,53.75 v8,53.75
  Bottom 0.254: IC1.3 8.7,53.25 v8,53.75
N$36
  Bottom 0.254: IC1.34 20.7,41.25 21.2,41.75 R23.1
N$37
  Top 0.254: R27.2 LED3.A
N$45
  Bottom 0.254: IC1.35 24,40.75 28.45,36.3 34.1,36.3 R28.1
N$46
  Bottom 0.254: R34.2 11.4,30 13,30 13.25,30.25 31.7,30.25 32.25,30.8 41.7,30.8 FB3.2
N$47
  Bottom 0.254: R35.2 36.5,31.55 FB2.2
N$49  (via drill 0.6)
  Top 0.254: U$6.4 40.55,33.3 v40.75,33.5
  Bottom 0.254: 40.55,32.9 FB2.1 40.6,33.35 v40.75,33.5
N$50  (via drill 0.6)
  Top 0.254: U$6.5 41.65,33.15 v42,33.5
  Bottom 0.254: 41.85,33.35 v42,33.5 42.45,33.05 FB3.1
PWR-USB-SENSE  (via drill 0.6)
  Top 0.254: v17.2,51.45 16.4,52.25 R7.1
  Bottom 0.254: 17.2,49 IC1.20 v17.2,51.45
SBW-TCK
  Bottom 0.254: IC1.23 21.3,46.75 22.5,47.95 22.5,49.75 23.04,50.29 SBW.3
SBW-TDO/TDI
  Top 0.254: R3.1 22.75,51.6 22.75,48.75 23.75,47.75 SBW.2
  Bottom 0.254: IC1.24 23,46.25 | 23,46.25 23.5,46.25 SBW.2 26.99,47.75 S4.3 29.49,45.25 34.01,45.25 S4.4 | C15.1 23,43.65 23,46.25
SPICLK
  Top 0.254: U$1.2 11.13,47.9 R32.2
SPICSN
  Top 0.254: U$1.4 8.6,47.9 R31.2
SPISI
  Top 0.254: U$1.1 12.5,45.97 R29.2
SPISO  (via drill 0.6)
  Top 0.254: v15,51.25 15.5,50.75 R30.2
  Bottom 0.254: IC1.5 9.7,50.95 10,51.25 v15,51.25
SW-CFG-GPS  (via drill 0.6)
  Top 0.254: v26.25,41.75 v23.75,39.25
  Bottom 0.254: S1.3 S1.4 26.25,41.76 v26.25,41.75 | v23.75,39.25 23.25,39.75 IC1.37
VBUS
  Top 0.406: C28.+ 32.5,12.28 27.27,12.28 IC3.20 27.27,18.82 25.9,20.2 23.05,20.2 C21.2
  Top 0.61: U$4.1 12.05,19.9 10.15,19.9 U$4.3 10.15,21.55 9.5,22.2 8.9,22.2 7.9,21.2 C27.+ 7.9,22.35 R27.1 | C28.+ 31.8,14.18 31.8,20.9 27.6,25.1 9.4,25.1 9.45,25.05 R27.1 | FUSE1.1 9.05,23.5 R27.1
VCC  (via drill 0.6)
  Top 0.254: 4.8,39.75 4.6,39.55 | C2.2 9.86,37.94 U$1.6 | R2.2 v14,53.75 | R1.1 8.2,35.1 | S2.3.2 25,35.99 S1.2 S1.1 | R3.2 v24.75,53.5 | v28.2,58.35 28.6,58.35 TP-VCC.TP
  Top 0.61: C2.2 C1.2 10.55,33 10.5,32.95 | v2.6,39.75 4.8,39.75 | v8.2,32.95 8.5,33.25 R1.1
  Top 1.27: 2.77,49.12 v2.88,49.23 | v2.88,49.23 4.6,46.95 4.6,39.55 4.6,33.9 5.55,32.95 v8.2,32.95 10.5,32.95 12.4,32.95 v13.2,32.25 15.2,30.25 23.5,30.25 25,31.75 S2.3.1 S2.3.2 | v11.1,55.25 6.8,55.25 5.5,53.95 5.5,51.85 v2.88,49.23
  Bottom 0.254: IC1.47 14.2,33.75 C5.2 | C3.2 4.2,47.85 4.8,47.25 IC1.79 | IC1.64 3.45,39.75 | IC1.60 7.7,34.65 C12.2 | C7.1 21.2,47.55 20.9,47.25 IC1.22 | v28.2,58.35 26,58.35 C18.1 | v24.75,53.5 22.7,53.5 | 21.2,52.65 22.7,52.65 22.7,53.25 | 22.15,56.05 22.7,56.05 22.7,56.25 | 22.7,58.6 22.4,58.6 22.4,58.8
  Bottom 0.305: U$2.9 22.7,59.05 22.7,58.6 | U$2.10 22.15,58.55 22.4,58.8 | U$2.15 22.15,56.05 22.4,55.8 22.15,55.55 U$2.16
  Bottom 0.61: C8.1 C7.1 | C10.1 3.45,39.75 | 3.45,39.75 C9.1 | C3.2 C4.2 1.85,48.2 v2.88,49.23 | C11.2 C12.2 8.2,33.95 v8.2,32.95 | 3.45,39.75 v2.6,39.75
  Bottom 1.27: 12.7,53.75 v14,53.75 | v13.2,32.25 14.25,32.25 C6.2 C5.2 | v14,53.75 14.8,52.95 22.7,52.95 22.7,53.25 22.7,53.5 22.7,56.25 22.7,56.75 | 18.3,52.65 21.2,52.65 C8.1 | v11.1,55.25 12.6,53.75 v14,53.75 | 22.7,56.75 22.7,58.6 | C18.1 22.7,56.75
VCC_BATT_IN  (1 unrouted)
  Top 1.016: C25.1 17.01,59.1 G2.+
  Bottom 0.305: U$2.7 15.75,58.55 15.4,58.9 15.4,60.23 G2.+ 15.9,60.21 15.9,59.3 16.15,59.05 U$2.8
  Bottom 1.016: 15.6,60.5 15.7,60.5 15.7,59.7
VCCUSB  (via drill 0.6)
  Top 0.254: LED2.2 LED2.4
  Top 0.406: v14,15.6 14,18.43 C22.+ | v16.9,12.7 18.1,13.9 LED2.4 | LED2.2 19.85,14.15 24.02,9.97 IC3.4 24.02,6.67 R10.1
  Top 0.61: C22.+ 12.22,18.52 U$4.5 | 19.85,14.15 20.3,13.7 R9.1 20.25,6.2 20.25,8.3 16.7,8.3 15.2,6.8 15.2,4.8 17.2,2.8 19.7,2.8 20.09,2.41 JP1.1
  Bottom 0.406: v16.9,12.7 v14,15.6
VCCUSBGPS  (via drill 0.6)
  Top 0.254: R7.2 17.9,53.2 C24.2
  Top 0.61: JP2.1 13.36,55.2 v15.9,55.2
  Top 1.016: C24.2 16.2,55.5 v15.9,55.2
  Bottom 0.254: U$2.2 15.9,56.05 v15.9,55.2 | R4.1 11.6,58.75 JP2.1
  Bottom 0.406: U$2.1 15.95,55.55 15.9,55.5 v15.9,55.2
(copper drawn outside any net)
  shapes: Top area x1

### Text on the board
tText: PWRBATT | PWRUSB | VCC | GND TX RX VCC | GND-RST-TST | CFG GPS | taGPS v1350-0.31 | ADC-VREF | GPS: ON - OFF | VCC - TX - RX - GND